# EAGLE schematic RocketSenseV2 (EAGLE 6.5.0)
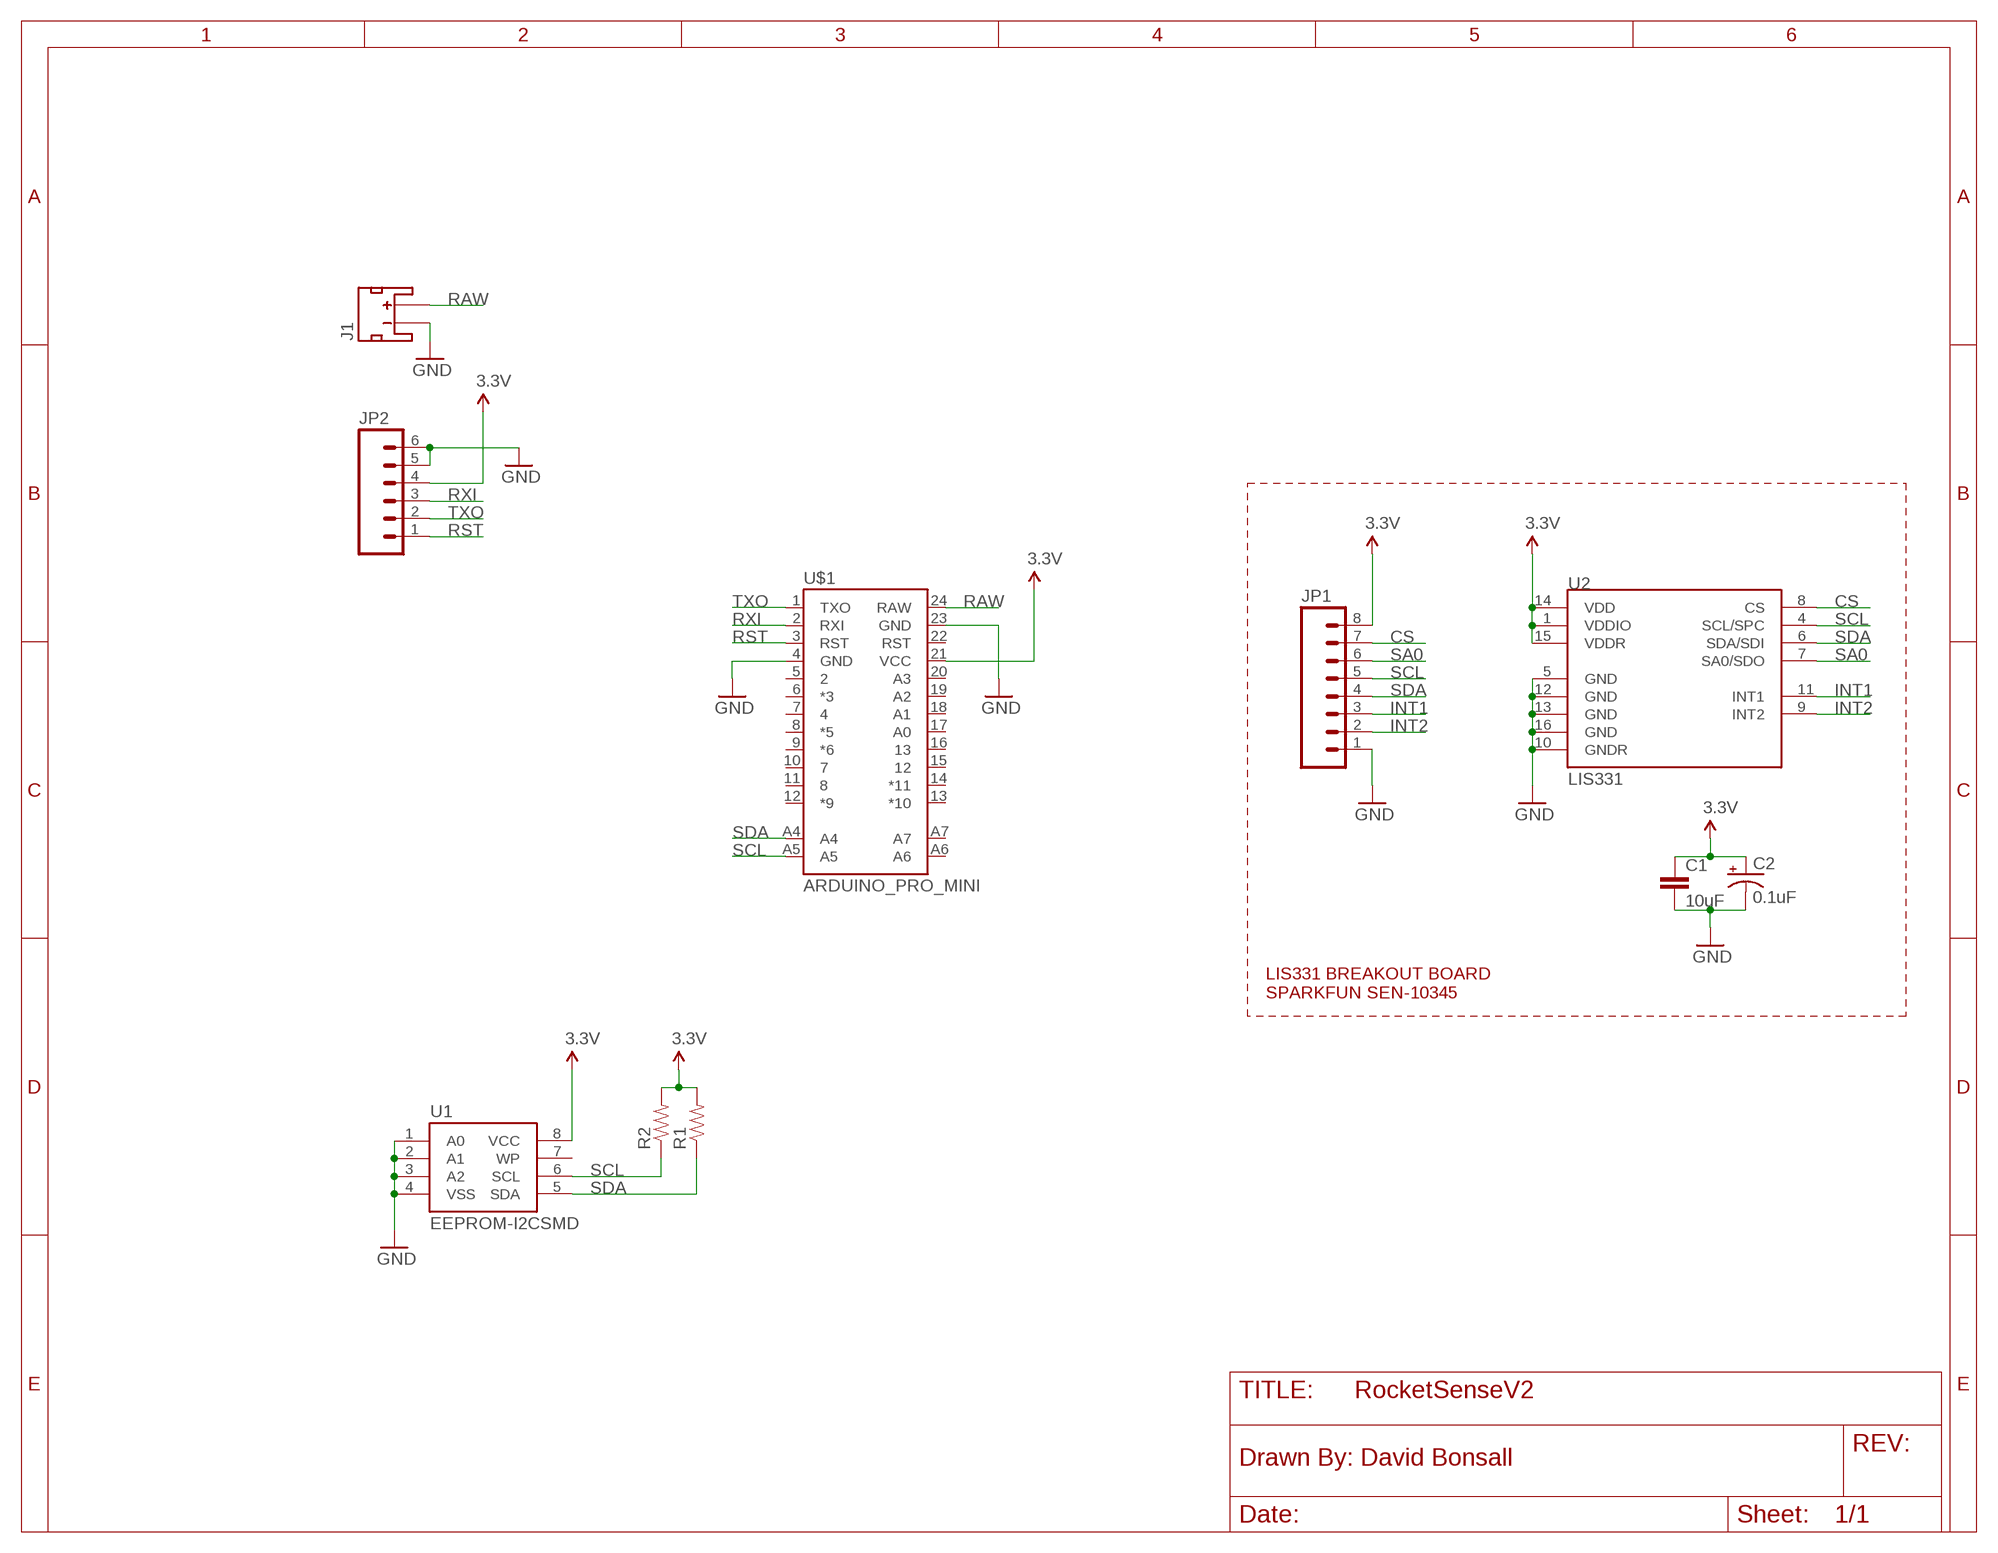
[diagram p0: schematic, sheet 1]

## Parts
C1  10uF  CAP0402-CAP  [0402-CAP]
C2  0.1uF  CAP_POL1206  [EIA3216]
J1  JST_2MM_MALE  [JST-2-SMD]
JP1  M08  [1X08_PIN1_NO_SILK]
JP2  M06SIP  [1X06]
R1  RESISTORPTH-1/6W  [1/6W-RES]
R2  RESISTORPTH-1/6W  [1/6W-RES]
U1  EEPROM-I2CSMD  [SO08]
U2  LIS331  [LGA16-3MM]
U$1  ARDUINO_PRO_MINI  [ARDUINO_PRO_MINI]

## Nets
3.3V: C1.1 C2.A(+) JP1.8 JP2.4 R1.2 R2.2 U1.8(VCC) U2.1(VDDIO) U2.14(VDD) U2.15(VDDR) U$1.21(VCC)
CS: JP1.7 U2.8(CS)
GND: C1.2 C2.C(-) J1.1(-) JP1.1 JP2.5 JP2.6 U1.1(A0) U1.2(A1) U1.3(A2) U1.4(VSS) U2.5(GND) U2.10(GNDR) U2.12(GND) U2.13(GND) U2.16(GND) U$1.4(GND) U$1.23(GND)
INT1: JP1.3 U2.11(INT1)
INT2: JP1.2 U2.9(INT2)
RAW: J1.2(+) U$1.24(RAW)
RST: JP2.1 U$1.3(RST)
RXI: JP2.3 U$1.2(RXI)
SA0: JP1.6 U2.7(SA0/SDO)
SCL: JP1.5 R2.1 U1.6(SCL) U2.4(SCL/SPC) U$1.A5
SDA: JP1.4 R1.1 U1.5(SDA) U2.6(SDA/SDI) U$1.A4
TXO: JP2.2 U$1.1(TXO)
Unconnected: J1.NC1(PAD1) J1.NC2(PAD2) U1.7(WP) U$1.5 U$1.6(*3) U$1.7 U$1.8(*5) U$1.9(*6) U$1.10 U$1.11 U$1.12(*9) U$1.13(*10) U$1.14(*11) U$1.15 U$1.16 U$1.17(A0) U$1.18(A1) U$1.19(A2) U$1.20(A3) U$1.22(RST) U$1.A6 U$1.A7

## Notes on the sheet
- LIS331 BREAKOUT BOARD
  SPARKFUN SEN-10345

## Library data of the parts
C1 = SparkFun-Passives:CAP: Capacitor Standard 0603 ceramic capacitor, and 0.1" leaded capacitor.
C2 = SparkFun-Passives:CAP_POL: Capacitor Polarized These are standard SMD and PTH capacitors. Normally 10uF, 47uF, and 100uF in electrolytic and tantalum varieties. Always verify the external diameter of the through hole cap, it varies with capacity, voltage, and manufacturer. The EIA devices should be standard.
J1 = SparkFun-Connectors:JST_2MM_MALE: Mates to single-cell LiPo batteries. CONN-08352; PROD_ID: CONN-08352
JP1 = SparkFun-Connectors:M08: Header 8 Standard 8-pin 0.1" header. Use with straight break away headers (SKU : PRT-00116), right angle break away headers (PRT-00553), swiss pins (PRT-00743), machine pins (PRT-00117), and female headers (PRT-00115).
JP2 = SparkFun-Connectors:M06: Header 6 Standard 6-pin 0.1" header. Use with straight break away headers (SKU : PRT-00116), right angle break away headers (PRT-00553), swiss pins (PRT-00743), machine pins (PRT-00117), and female headers (PRT-00115). Molex polarized connector foot print use with SKU : PRT-08094 with associated crimp pins and housings. NOTES ON THE VARIANTS LOCK and LOCK_LONGPADS... This footprint was designed to help hold the alignment of a through-hole component (i.e. 6-pin header) while soldering it into place. You may notice that each hole has been shifted either up or down by 0.005 of an inch from it's more standard position (which is a perfectly straight line). This slight alteration caused the pins (the squares in the middle) to touch the edges of the holes. Because they are alternating, it causes a "brace" to hold the component in place. 0.005 has proven to be the perfect amount of "off-center" position when using our standard breakaway headers. Although looks a little odd when you look at the bare footprint, once you have a header in there, the alteration is very hard to notice. Also,if you push a header all the way into place, it is covered up entirely on the bottom side. This idea of altering the position of holes to aid alignment will be further integrated into the Sparkfun Library for other footprints. It can help hold any component with 3 or more connection pins.
R1 R2 = SparkFun-Passives:RESISTOR: Resistor Basic schematic elements and footprints for 0603, 1206, and PTH resistors.
U1 = SparkFun-DigitalIC:EEPROM-I2C: I2C EEPROM chips, 24LC256 (and others)
U2 = SparkFun-Sensors:LIS331: 3-axis 6/12/24g SPI/I2C accelerometer
U$1 = SparkFun-Boards:ARDUINO_PRO_MINI